# Altium schematic sheet FPGA_D_F.SchDoc: FIT_PM12 board
size 420 x 297 mm; CheckedBy: G.Kasprowicz; Author: INR Moscow; CompanyName: WUT ISE; DrawnBy: M.Podgórski; Organization: WUT ISE; Address1: PW ISE; Address2: Nowowiejska 15/19 00-665 Warsaw; Address3: gkasprow@gmail.com; DocumentNumber: 31; Revision: 2; SheetNumber: 30; SheetTotal: 34; ModifiedBy: -; CheckedDate: -; Title2: FPGA D F TDC3; DivGrp: WUT ISE; Designer: INR RAS; ModifiedDate: -; ProjectName: Sensor Box
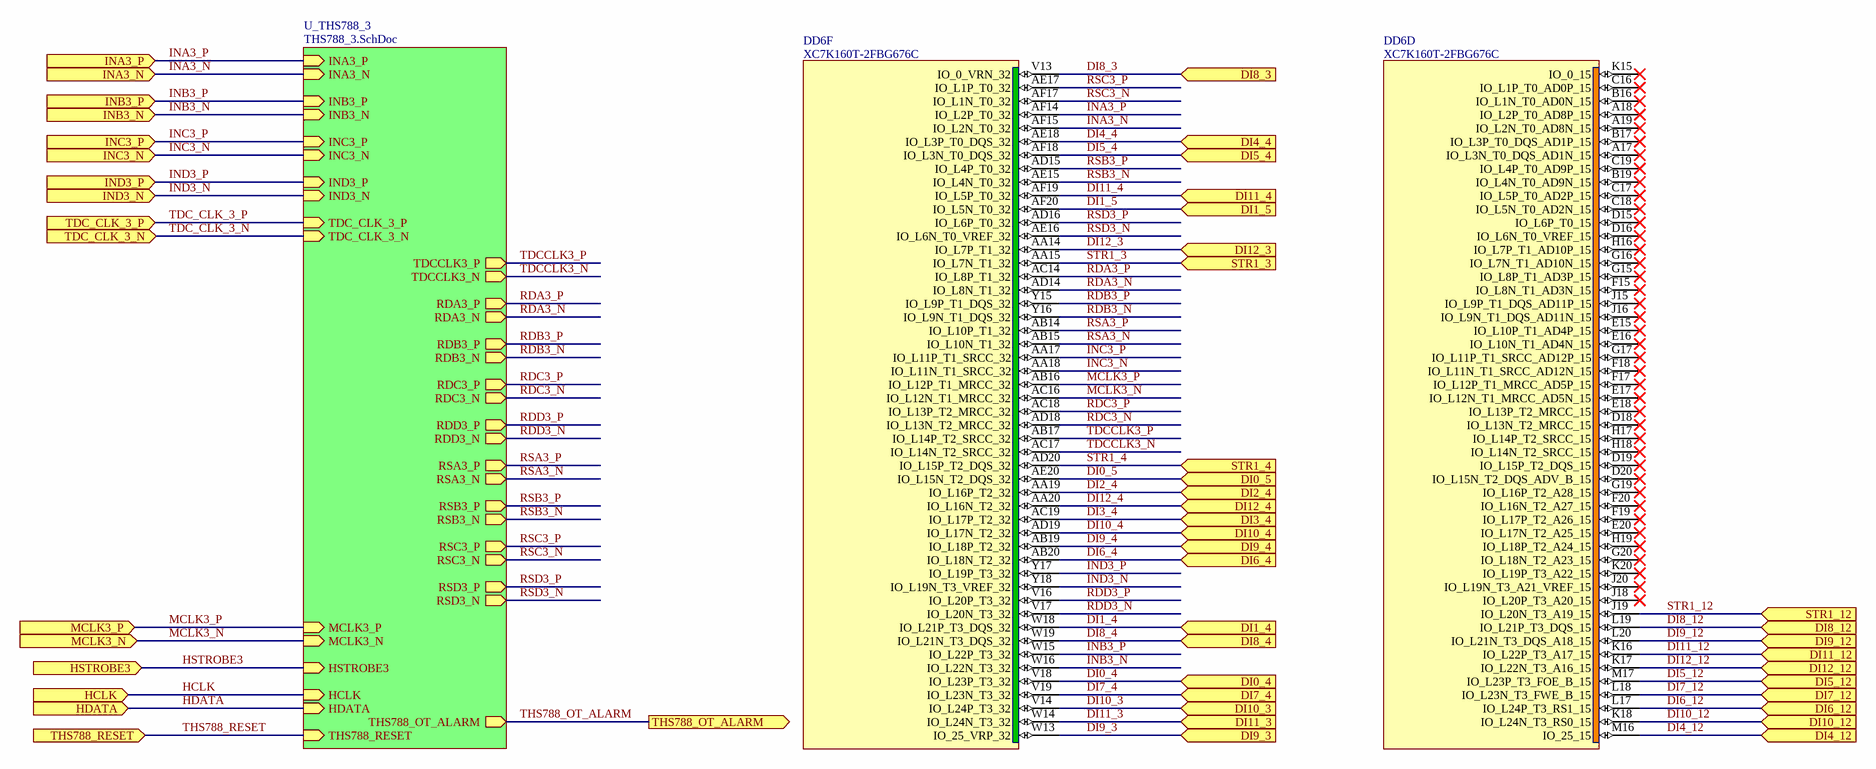
[diagram p0: FPGA_D_F.SchDoc]

## Parts
DD6  XC7K160T-2FBG676C  [BGA676C100P26X26_2700X2700X254]  (parts D,F of 15)

## Sub-sheets
U_THS788_3 = THS788_3.SchDoc: INC3_P (in), INC3_N (in), IND3_N (in), IND3_P (in), RDD3_P (out), RDD3_N (out), RSD3_P (out), RSD3_N (out), HDATA (in), HCLK (in), HSTROBE3 (in), TDCCLK3_P (out), TDCCLK3_N (out), RSB3_P (out), RSB3_N (out), RDB3_P (out), RDB3_N (out), THS788_OT_ALARM (out), THS788_RESET (in), MCLK3_N (in), MCLK3_P (in), INB3_N (in), INB3_P (in), TDC_CLK_3_P (in), TDC_CLK_3_N (in), INA3_P (in), INA3_N (in), RDA3_N (out), RDA3_P (out), RSA3_P (out), RSA3_N (out), RSC3_N (out), RSC3_P (out), RDC3_N (out), RDC3_P (out)

## Ports
DI0_4 (in), DI0_5 (in), DI1_4 (in), DI1_5 (in), DI2_4 (in), DI3_4 (in), DI4_4 (in), DI4_12 (in), DI5_4 (in), DI5_12 (in), DI6_4 (in), DI6_12 (in), DI7_4 (in), DI7_12 (in), DI8_3 (in), DI8_4 (in), DI8_12 (in), DI9_3 (in), DI9_4 (in), DI9_12 (in), DI10_3 (in), DI10_4 (in), DI10_12 (in), DI11_3 (in), DI11_4 (in), DI11_12 (in), DI12_3 (in), DI12_4 (in), DI12_12 (in), HCLK (in), HDATA (in), HSTROBE3 (in), INA3_N (in), INA3_P (in), INB3_N (in), INB3_P (in), INC3_N (in), INC3_P (in), IND3_N (in), IND3_P (in), MCLK3_N (in), MCLK3_P (in), STR1_3 (in), STR1_4 (in), STR1_12 (in), TDC_CLK_3_N (in), TDC_CLK_3_P (in), THS788_OT_ALARM (out), THS788_RESET (in)

## Nets
DI0_4: DD6.V18(IO_L23P_T3_32) ; port DI0_4
DI0_5: DD6.AE20(IO_L15N_T2_DQS_32) ; port DI0_5
DI1_4: DD6.W18(IO_L21P_T3_DQS_32) ; port DI1_4
DI1_5: DD6.AF20(IO_L5N_T0_32) ; port DI1_5
DI2_4: DD6.AA19(IO_L16P_T2_32) ; port DI2_4
DI3_4: DD6.AC19(IO_L17P_T2_32) ; port DI3_4
DI4_4: DD6.AE18(IO_L3P_T0_DQS_32) ; port DI4_4
DI4_12: DD6.M16(IO_25_15) ; port DI4_12
DI5_4: DD6.AF18(IO_L3N_T0_DQS_32) ; port DI5_4
DI5_12: DD6.M17(IO_L23P_T3_FOE_B_15) ; port DI5_12
DI6_4: DD6.AB20(IO_L18N_T2_32) ; port DI6_4
DI6_12: DD6.L17(IO_L24P_T3_RS1_15) ; port DI6_12
DI7_4: DD6.V19(IO_L23N_T3_32) ; port DI7_4
DI7_12: DD6.L18(IO_L23N_T3_FWE_B_15) ; port DI7_12
DI8_3: DD6.V13(IO_0_VRN_32) ; port DI8_3
DI8_4: DD6.W19(IO_L21N_T3_DQS_32) ; port DI8_4
DI8_12: DD6.L19(IO_L21P_T3_DQS_15) ; port DI8_12
DI9_3: DD6.W13(IO_25_VRP_32) ; port DI9_3
DI9_4: DD6.AB19(IO_L18P_T2_32) ; port DI9_4
DI9_12: DD6.L20(IO_L21N_T3_DQS_A18_15) ; port DI9_12
DI10_3: DD6.V14(IO_L24P_T3_32) ; port DI10_3
DI10_4: DD6.AD19(IO_L17N_T2_32) ; port DI10_4
DI10_12: DD6.K18(IO_L24N_T3_RS0_15) ; port DI10_12
DI11_3: DD6.W14(IO_L24N_T3_32) ; port DI11_3
DI11_4: DD6.AF19(IO_L5P_T0_32) ; port DI11_4
DI11_12: DD6.K16(IO_L22P_T3_A17_15) ; port DI11_12
DI12_3: DD6.AA14(IO_L7P_T1_32) ; port DI12_3
DI12_4: DD6.AA20(IO_L16N_T2_32) ; port DI12_4
DI12_12: DD6.K17(IO_L22N_T3_A16_15) ; port DI12_12
HCLK: port HCLK, sheet U_THS788_3/HCLK
HDATA: port HDATA, sheet U_THS788_3/HDATA
HSTROBE3: port HSTROBE3, sheet U_THS788_3/HSTROBE3
INA3_N: DD6.AF15(IO_L2N_T0_32) ; port INA3_N, sheet U_THS788_3/INA3_N
INA3_P: DD6.AF14(IO_L2P_T0_32) ; port INA3_P, sheet U_THS788_3/INA3_P
INB3_N: DD6.W16(IO_L22N_T3_32) ; port INB3_N, sheet U_THS788_3/INB3_N
INB3_P: DD6.W15(IO_L22P_T3_32) ; port INB3_P, sheet U_THS788_3/INB3_P
INC3_N: DD6.AA18(IO_L11N_T1_SRCC_32) ; port INC3_N, sheet U_THS788_3/INC3_N
INC3_P: DD6.AA17(IO_L11P_T1_SRCC_32) ; port INC3_P, sheet U_THS788_3/INC3_P
IND3_N: DD6.Y18(IO_L19N_T3_VREF_32) ; port IND3_N, sheet U_THS788_3/IND3_N
IND3_P: DD6.Y17(IO_L19P_T3_32) ; port IND3_P, sheet U_THS788_3/IND3_P
MCLK3_N: DD6.AC16(IO_L12N_T1_MRCC_32) ; port MCLK3_N, sheet U_THS788_3/MCLK3_N
MCLK3_P: DD6.AB16(IO_L12P_T1_MRCC_32) ; port MCLK3_P, sheet U_THS788_3/MCLK3_P
RDA3_N: DD6.AD14(IO_L8N_T1_32) ; sheet U_THS788_3/RDA3_N
RDA3_P: DD6.AC14(IO_L8P_T1_32) ; sheet U_THS788_3/RDA3_P
RDB3_N: DD6.Y16(IO_L9N_T1_DQS_32) ; sheet U_THS788_3/RDB3_N
RDB3_P: DD6.Y15(IO_L9P_T1_DQS_32) ; sheet U_THS788_3/RDB3_P
RDC3_N: DD6.AD18(IO_L13N_T2_MRCC_32) ; sheet U_THS788_3/RDC3_N
RDC3_P: DD6.AC18(IO_L13P_T2_MRCC_32) ; sheet U_THS788_3/RDC3_P
RDD3_N: DD6.V17(IO_L20N_T3_32) ; sheet U_THS788_3/RDD3_N
RDD3_P: DD6.V16(IO_L20P_T3_32) ; sheet U_THS788_3/RDD3_P
RSA3_N: DD6.AB15(IO_L10N_T1_32) ; sheet U_THS788_3/RSA3_N
RSA3_P: DD6.AB14(IO_L10P_T1_32) ; sheet U_THS788_3/RSA3_P
RSB3_N: DD6.AE15(IO_L4N_T0_32) ; sheet U_THS788_3/RSB3_N
RSB3_P: DD6.AD15(IO_L4P_T0_32) ; sheet U_THS788_3/RSB3_P
RSC3_N: DD6.AF17(IO_L1N_T0_32) ; sheet U_THS788_3/RSC3_N
RSC3_P: DD6.AE17(IO_L1P_T0_32) ; sheet U_THS788_3/RSC3_P
RSD3_N: DD6.AE16(IO_L6N_T0_VREF_32) ; sheet U_THS788_3/RSD3_N
RSD3_P: DD6.AD16(IO_L6P_T0_32) ; sheet U_THS788_3/RSD3_P
STR1_3: DD6.AA15(IO_L7N_T1_32) ; port STR1_3
STR1_4: DD6.AD20(IO_L15P_T2_DQS_32) ; port STR1_4
STR1_12: DD6.J19(IO_L20N_T3_A19_15) ; port STR1_12
TDC_CLK_3_N: port TDC_CLK_3_N, sheet U_THS788_3/TDC_CLK_3_N
TDC_CLK_3_P: port TDC_CLK_3_P, sheet U_THS788_3/TDC_CLK_3_P
TDCCLK3_N: DD6.AC17(IO_L14N_T2_SRCC_32) ; sheet U_THS788_3/TDCCLK3_N
TDCCLK3_P: DD6.AB17(IO_L14P_T2_SRCC_32) ; sheet U_THS788_3/TDCCLK3_P
THS788_OT_ALARM: port THS788_OT_ALARM, sheet U_THS788_3/THS788_OT_ALARM
THS788_RESET: port THS788_RESET, sheet U_THS788_3/THS788_RESET

Not connected (* = marked no-connect by the designer): DD6 A17(IO_L3N_T0_DQS_AD1N_15)* A18(IO_L2P_T0_AD8P_15)* A19(IO_L2N_T0_AD8N_15)* B16(IO_L1N_T0_AD0N_15)* B17(IO_L3P_T0_DQS_AD1P_15)* B19(IO_L4N_T0_AD9N_15)* C16(IO_L1P_T0_AD0P_15)* C17(IO_L5P_T0_AD2P_15)* C18(IO_L5N_T0_AD2N_15)* C19(IO_L4P_T0_AD9P_15)* D15(IO_L6P_T0_15)* D16(IO_L6N_T0_VREF_15)* D18(IO_L13N_T2_MRCC_15)* D19(IO_L15P_T2_DQS_15)* D20(IO_L15N_T2_DQS_ADV_B_15)* E15(IO_L10P_T1_AD4P_15)* E16(IO_L10N_T1_AD4N_15)* E17(IO_L12N_T1_MRCC_AD5N_15)* E18(IO_L13P_T2_MRCC_15)* E20(IO_L17N_T2_A25_15)* F15(IO_L8N_T1_AD3N_15)* F17(IO_L12P_T1_MRCC_AD5P_15)* F18(IO_L11N_T1_SRCC_AD12N_15)* F19(IO_L17P_T2_A26_15)* F20(IO_L16N_T2_A27_15)* G15(IO_L8P_T1_AD3P_15)* G16(IO_L7N_T1_AD10N_15)* G17(IO_L11P_T1_SRCC_AD12P_15)* G19(IO_L16P_T2_A28_15)* G20(IO_L18N_T2_A23_15)* H16(IO_L7P_T1_AD10P_15)* H17(IO_L14P_T2_SRCC_15)* H18(IO_L14N_T2_SRCC_15)* H19(IO_L18P_T2_A24_15)* J15(IO_L9P_T1_DQS_AD11P_15)* J16(IO_L9N_T1_DQS_AD11N_15)* J18(IO_L20P_T3_A20_15)* J20(IO_L19N_T3_A21_VREF_15)* K15(IO_0_15)* K20(IO_L19P_T3_A22_15)*

## Notes on the sheet
- Project/Equipment
- Document
- Designer
- Drawn by
- Check.by
- Copyright WUT ISE 2024.
  This documentation describes Open Hardware and is licensed under the CERN OHL v.2. You may redistribute and modify this documentation under the terms of the CERN OHL v.2. (http://ohwr.org/CERNOHL). This documentation is distributed WITHOUT ANY EXPRESS OR IMPLIED WARRANTY, INCLUDING OF MERCHANTABILITY, SATISFACTORY QUALITY AND FITNESS FOR A PARTICULAR PURPOSE. Please see the CERN OHL v.2 for applicable conditions.
- Contact
- File
- Last Mod.
- Print Date
- Sheet
- Size
- A3
- of
- Rev

## Library data of the parts
DD6 = XC7K160T-2FBG676C: KINTEX-7, FPGA, 676-Ball BGA, Pb-Free; Part Description: KINTEX-7 FPGA, 162240 Logic Cells, 400 User I/O, 8 GTXs, 676-Ball BGA, Speed Grade 2, Commercial Grade, Pb-Free; Manufacturer: XILINX; PressFit: No; Bonding: No; Part Number: XC7K160T-2FBG676C; Component Kind: Standard; Component Type: Standard; Device: XC7K160T-2FBG676C; PackageDescription: BGA, 1.00mm Pitch, Square; 676 Pin, 26 Columns X 26 Rows, Body 27.0mm X 27.0mm X 2.54mm H, IPC Medium Density; Manufacturer Part Number: XC7K160T-2FBG676C; Pin Count: 676; Case: BGA676; Mounted: Yes; Socket: No; SMD: Yes; Sense: No; ComponentHeight: 2.54mm; HelpURL: \\cern.ch\dfs\Applications\Altium\Datasheets\XC7K160T-xFBG676C.pdf; ComponentLink1URL: \\cern.ch\dfs\Applications\Altium\Datasheets\XC7K160T-xFBG676C_Package-Pinout.pdf; ComponentLink1Description: Package/Pinout; Author: CERN DEM BC; CreateDate: 06.02.2020; LatestRevisionDate: 06.02.2020